# Altium schematic sheet CC2530.SchDoc
size A4
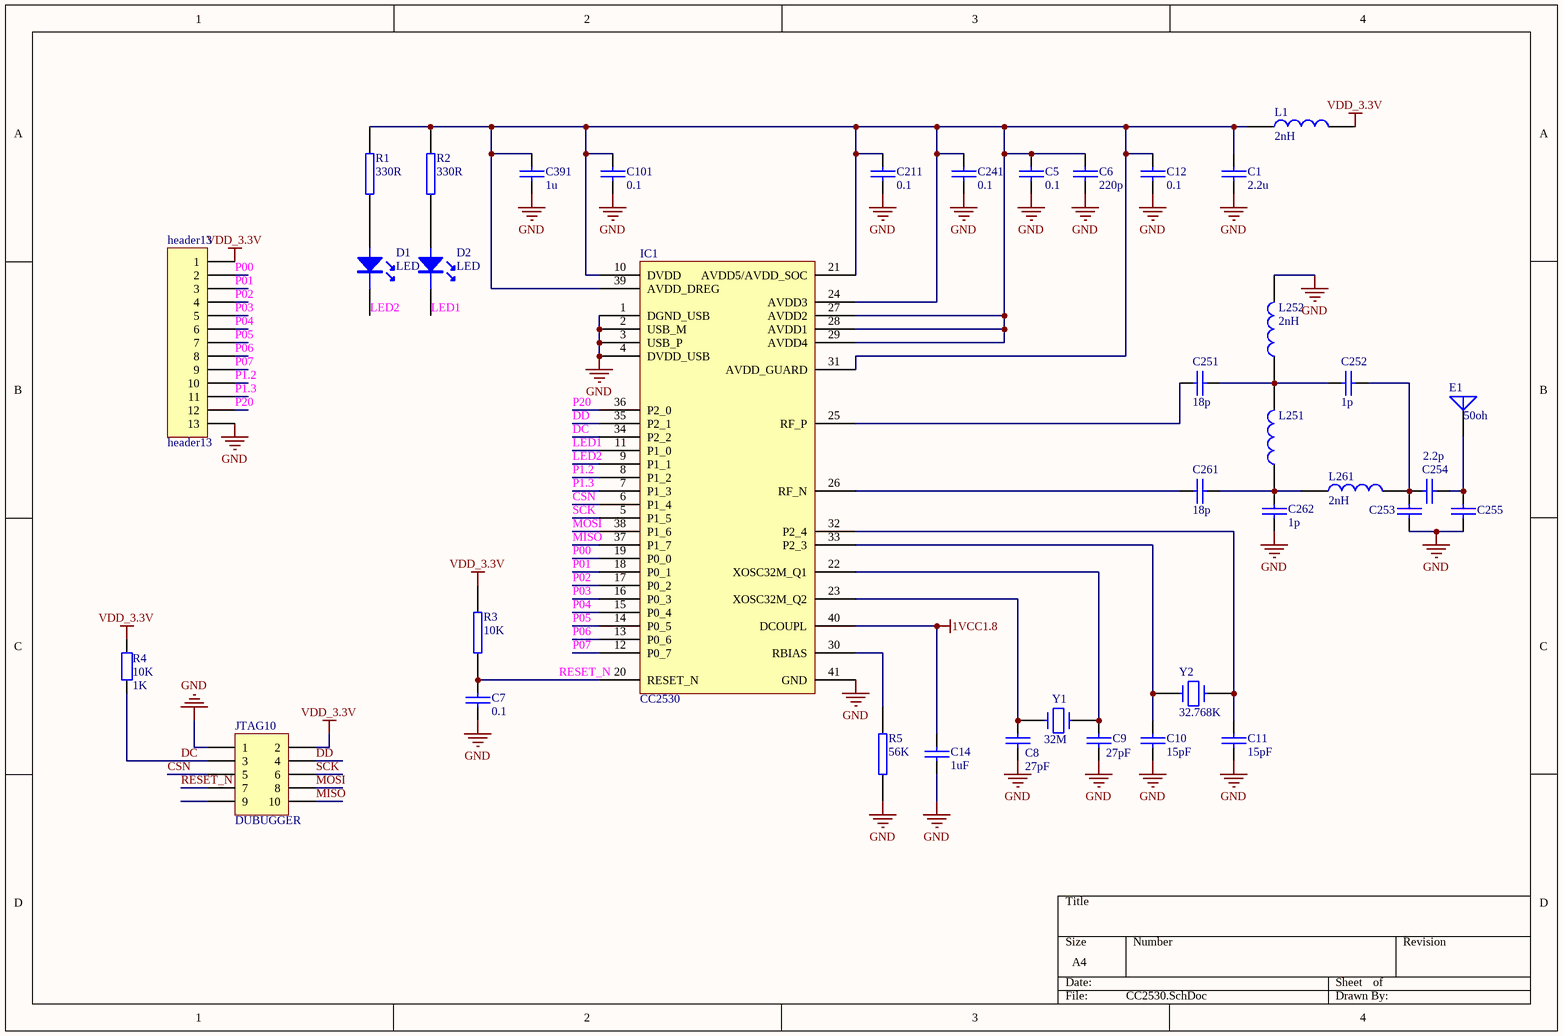
[diagram p0: CC2530.SchDoc]

## Parts
C1  2.2u  [0402]
C5  0.1  [0402]
C6  220p  [0402]
C7  0.1  [0402]
C8  27pF  [0402]
C9  27pF  [0402]
C10  15pF  [0402]
C11  15pF  [0402]
C12  0.1  [0402]
C14  1uF  [0402]
C101  0.1  [0402]
C211  0.1  [0402]
C241  0.1  [0402]
C251  18p  [0402]
C252  1p  [0402]
C253  (no value)  [0402]
C254  2.2p  [0402]
C255  (no value)  [0402]
C261  18p  [0402]
C262  1p  [0402]
C391  1u  [0402]
D1  LED  [LED-0603]
D2  LED  [LED-0603]
E1  50oh  [ANT]
header13  header13  [header13]
IC1  CC2530  [PVQFN-N40]
JTAG10  DUBUGGER  [JTAG]
L1  2nH  [0402]
L251  (no value)  [0402]
L252  2nH  [0402]
L261  2nH  [0402]
R1  330R  [0402]
R2  330R  [0402]
R3  10K  [0402]
R4  10K  value 1K  [rea0402]
R5  56K  [0402]
Y1  32M  [XT-SMD3225]
Y2  32.768K  [XT_3]

## Nets
1VCC1.8: C14.1 IC1.40(DCOUPL)
GND: C1.2 C5.2 C6.2 C7.2 C8.2 C9.2 C10.2 C11.2 C12.2 C14.2 C101.2 C211.2 C241.2 C253.2 C255.1 C262.2 C391.2 header13.13 IC1.1(DGND_USB) IC1.2(USB_M) IC1.3(USB_P) IC1.4(DVDD_USB) IC1.41(GND) JTAG10.1 L252.2 R5.2
VDD_3.3V: header13.1 JTAG10.2 L1.2 R3.2 R4.2
CSN: IC1.6(P1_4) JTAG10.5
DC: IC1.34(P2_2) JTAG10.3 R4.1
DD: IC1.35(P2_1) JTAG10.4
LED1: D2.K IC1.11(P1_0)
LED2: D1.K IC1.9(P1_1)
MISO: IC1.37(P1_7) JTAG10.10
MOSI: IC1.38(P1_6) JTAG10.8
P00: header13.2 IC1.19(P0_0)
P01: header13.3 IC1.18(P0_1)
P1.2: header13.10 IC1.8(P1_2)
P1.3: header13.11 IC1.7(P1_3)
P02: header13.4 IC1.17(P0_2)
P03: header13.5 IC1.16(P0_3)
P04: header13.6 IC1.15(P0_4)
P05: header13.7 IC1.14(P0_5)
P06: header13.8 IC1.13(P0_6)
P07: header13.9 IC1.12(P0_7)
P20: header13.12 IC1.36(P2_0)
RESET_N: C7.1 IC1.20(RESET_N) JTAG10.7 R3.1
SCK: IC1.5(P1_5) JTAG10.6
NetC1_1: C1.1 C5.1 C6.1 C12.1 C101.1 C211.1 C241.1 C391.1 IC1.10(DVDD) IC1.21(AVDD5/AVDD_SOC) IC1.24(AVDD3) IC1.27(AVDD2) IC1.28(AVDD1) IC1.29(AVDD4) IC1.31(AVDD_GUARD) IC1.39(AVDD_DREG) L1.1 R1.2 R2.2
NetC8_1: C8.1 IC1.23(XOSC32M_Q2) Y1.1
NetC9_1: C9.1 IC1.22(XOSC32M_Q1) Y1.2
NetC10_1: C10.1 IC1.33(P2_3) Y2.2
NetC11_1: C11.1 IC1.32(P2_4) Y2.1
NetC251_1: C251.1 IC1.25(RF_P)
NetC251_2: C251.2 C252.1 L251.2 L252.1
NetC252_2: C252.2 C253.1 C254.1 L261.2
NetC254_2: C254.2 C255.2 E1.1(A)
NetC261_1: C261.1 IC1.26(RF_N)
NetC261_2: C261.2 C262.1 L251.1 L261.1
NetD1_A: D1.A R1.1
NetD2_A: D2.A R2.1
NetIC1_30: IC1.30(RBIAS) R5.1

Not connected (* = marked no-connect by the designer): JTAG10 9

## Library data of the parts
C1 C5-C12 C14 C101 C211 C241 C251-C255 C261 C262 C391 = CAP: Capacitor
E1 = ANTENNA: Generic Antenna
JTAG10 = JTAG10
L1 L251 L252 L261 = INDUCTOR
R1-R3 R5 = RES2
R4 = res0402
Y1 Y2 = CRYSTAL